# EAGLE design Power Board Mk.4 (EAGLE 6.1)
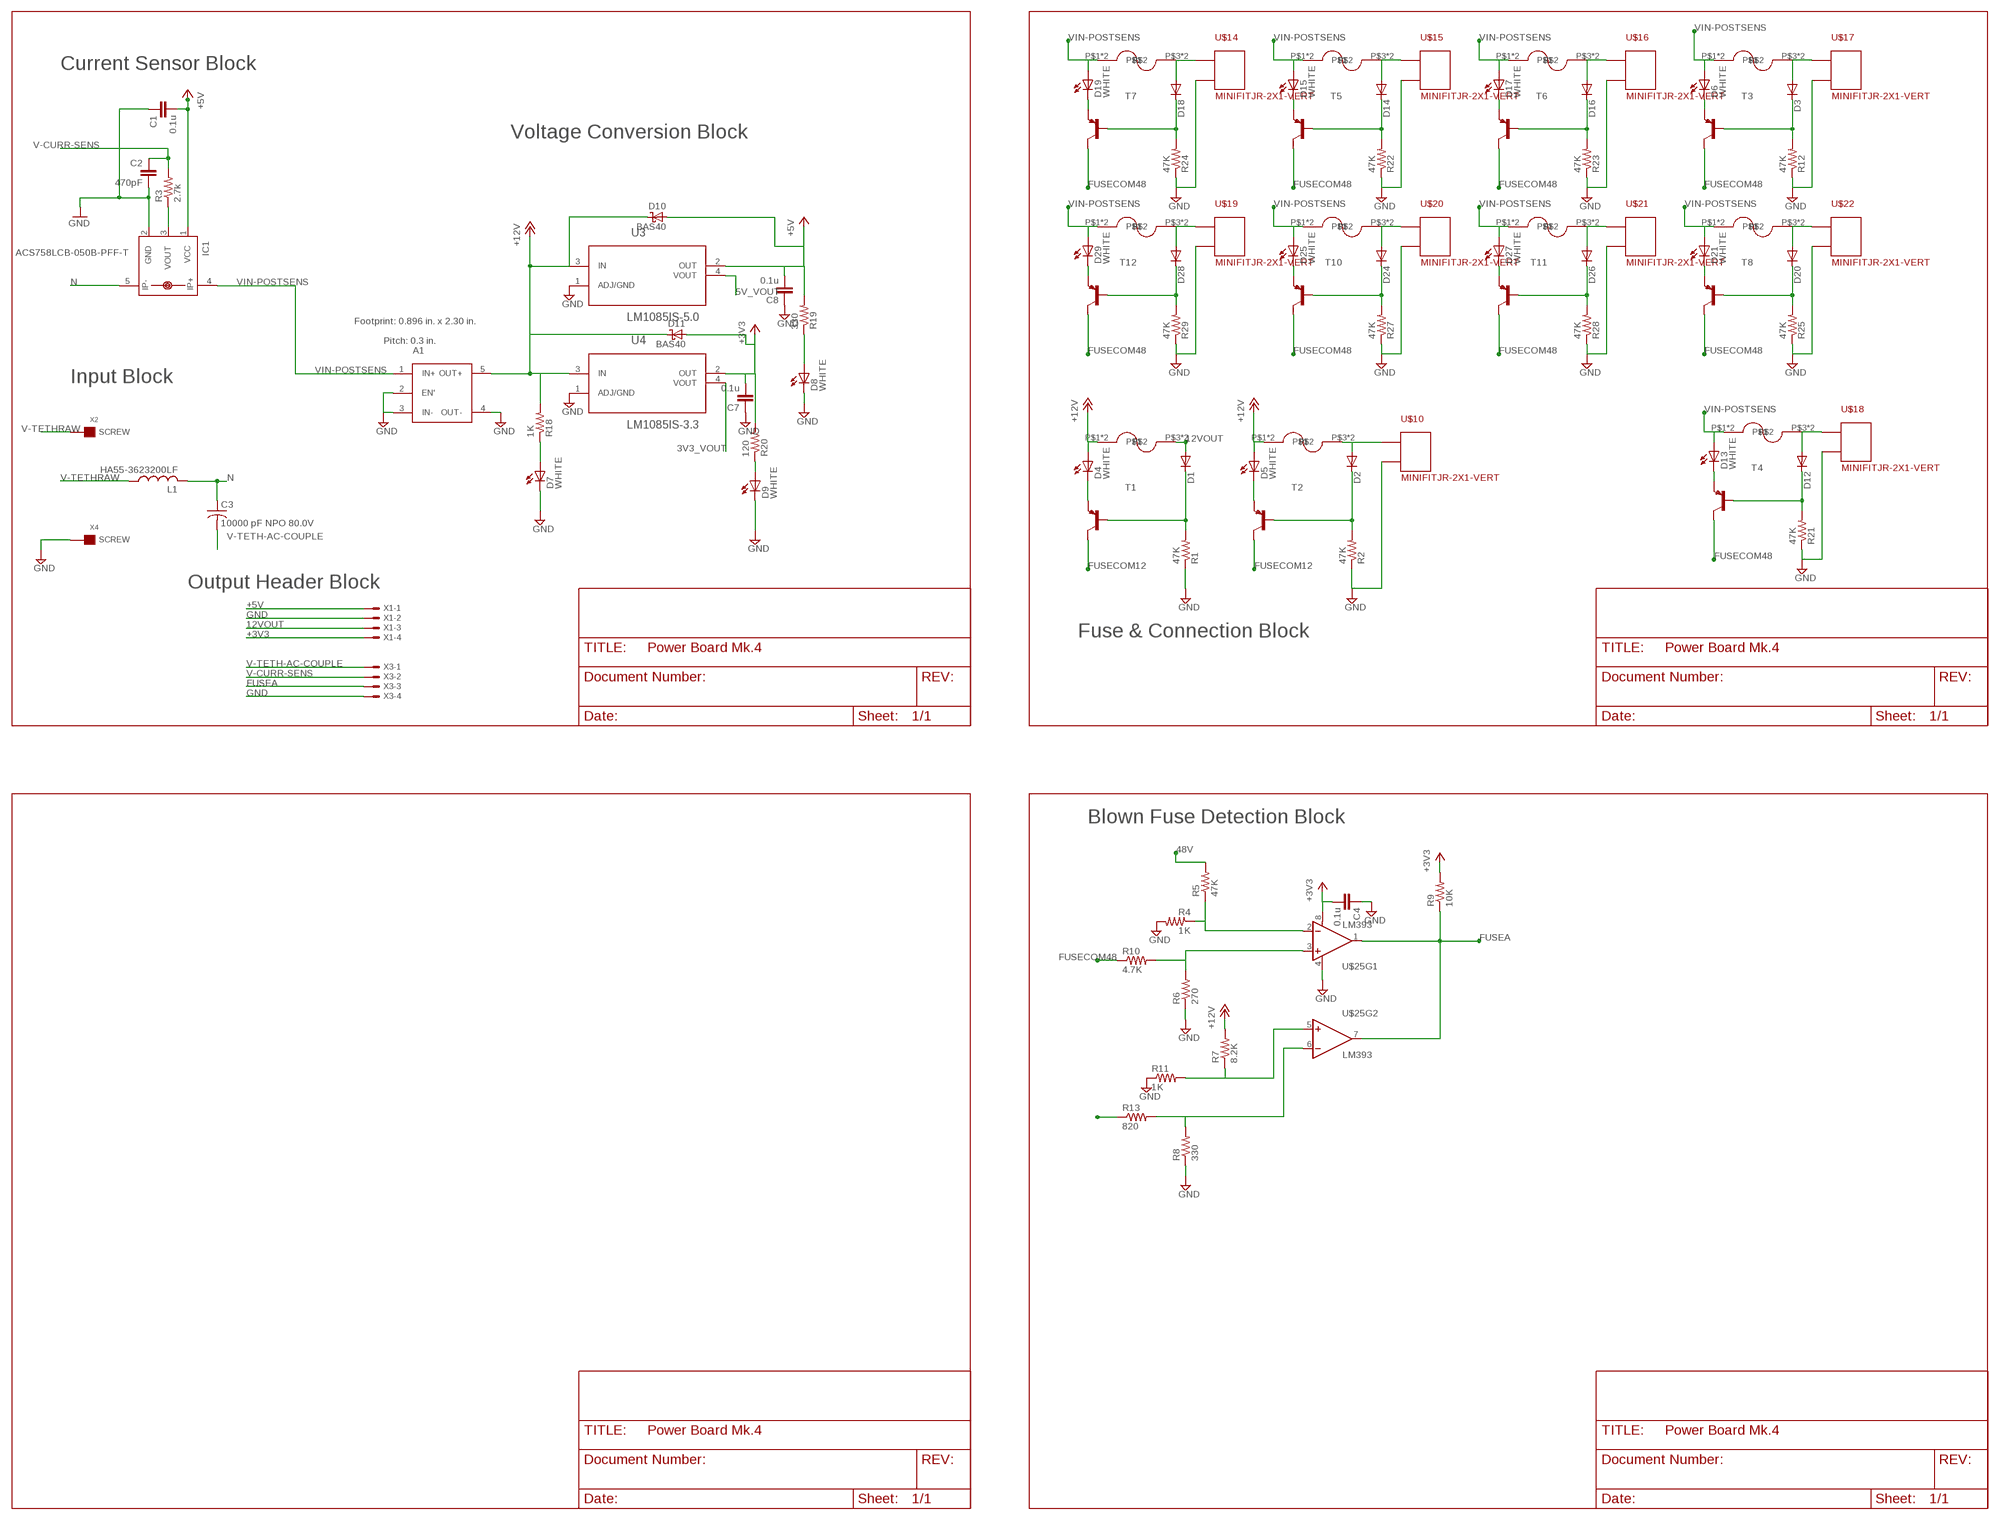
[diagram p0: schematic, sheet 1]

## Parts
A1  SQE48T20120  [BRICK]
C1  0.1u  CAP0805  [0805]
C2  470pF  CAP0805  [0805]
C3  10000 pF NPO 80.0V  C-USC0603  [C0603]
C4  0.1u  CAP0805  [0805]
C7  0.1u  CAP0805  [0805]
C8  0.1u  CAP0805  [0805]
D1  DIODEHV  [DIODE-HV]
D2  DIODEHV  [DIODE-HV]
D3  DIODEHV  [DIODE-HV]
D4  WHITE  LED-WHITE  [LED-1206]
D5  WHITE  LED-WHITE  [LED-1206]
D6  WHITE  LED-WHITE  [LED-1206]
D7  WHITE  LED-WHITE  [LED-1206]
D8  WHITE  LED-WHITE  [LED-1206]
D9  WHITE  LED-WHITE  [LED-1206]
D10  BAS40  [SOT23]
D11  BAS40  [SOT23]
D12  DIODEHV  [DIODE-HV]
D13  WHITE  LED-WHITE  [LED-1206]
D14  DIODEHV  [DIODE-HV]
D15  WHITE  LED-WHITE  [LED-1206]
D16  DIODEHV  [DIODE-HV]
D17  WHITE  LED-WHITE  [LED-1206]
D18  DIODEHV  [DIODE-HV]
D19  WHITE  LED-WHITE  [LED-1206]
D20  DIODEHV  [DIODE-HV]
D21  WHITE  LED-WHITE  [LED-1206]
D24  DIODEHV  [DIODE-HV]
D25  WHITE  LED-WHITE  [LED-1206]
D26  DIODEHV  [DIODE-HV]
D27  WHITE  LED-WHITE  [LED-1206]
D28  DIODEHV  [DIODE-HV]
D29  WHITE  LED-WHITE  [LED-1206]
IC1  ACS758LCB-050B-PFF-T  [CB-PFF]
L1  HA55-3623200LF  [THIND]
R1  47K  RESISTOR0805-RES  [0805]
R2  47K  RESISTOR0805-RES  [0805]
R3  2.7k  RESISTOR0805-RES  [0805]
R4  1K  RESISTOR0805-RES  [0805]
R5  47K  RESISTOR0805-RES  [0805]
R6  270  RESISTOR0805-RES  [0805]
R7  8.2K  RESISTOR0805-RES  [0805]
R8  330  RESISTOR0805-RES  [0805]
R9  10K  RESISTOR0805-RES  [0805]
R10  4.7K  RESISTOR0805-RES  [0805]
R11  1K  RESISTOR0805-RES  [0805]
R12  47K  RESISTOR0805-RES  [0805]
R13  820  RESISTOR0805-RES  [0805]
R18  1K  RESISTOR0805-RES  [0805]
R19  330  RESISTOR0805-RES  [0805]
R20  120  RESISTOR0805-RES  [0805]
R21  47K  RESISTOR0805-RES  [0805]
R22  47K  RESISTOR0805-RES  [0805]
R23  47K  RESISTOR0805-RES  [0805]
R24  47K  RESISTOR0805-RES  [0805]
R25  47K  RESISTOR0805-RES  [0805]
R27  47K  RESISTOR0805-RES  [0805]
R28  47K  RESISTOR0805-RES  [0805]
R29  47K  RESISTOR0805-RES  [0805]
T1  BC856BLT1-PNP-SOT23-BEC  [SOT23-BEC]
T2  BC856BLT1-PNP-SOT23-BEC  [SOT23-BEC]
T3  BC856BLT1-PNP-SOT23-BEC  [SOT23-BEC]
T4  BC856BLT1-PNP-SOT23-BEC  [SOT23-BEC]
T5  BC856BLT1-PNP-SOT23-BEC  [SOT23-BEC]
T6  BC856BLT1-PNP-SOT23-BEC  [SOT23-BEC]
T7  BC856BLT1-PNP-SOT23-BEC  [SOT23-BEC]
T8  BC856BLT1-PNP-SOT23-BEC  [SOT23-BEC]
T10  BC856BLT1-PNP-SOT23-BEC  [SOT23-BEC]
T11  BC856BLT1-PNP-SOT23-BEC  [SOT23-BEC]
T12  BC856BLT1-PNP-SOT23-BEC  [SOT23-BEC]
U3  LM1085IS-5.0  [TO254P1435X457-3N]
U4  LM1085IS-3.3  [TO254P1435X457-3N]
U$2  FUSEHOLDER3557-2  [FUSEHOLDER3557-2]
U$3  FUSEHOLDER3557-2  [FUSEHOLDER3557-2]
U$4  FUSEHOLDER3557-2  [FUSEHOLDER3557-2]
U$5  FUSEHOLDER3557-2  [FUSEHOLDER3557-2]
U$6  FUSEHOLDER3557-2  [FUSEHOLDER3557-2]
U$7  FUSEHOLDER3557-2  [FUSEHOLDER3557-2]
U$8  FUSEHOLDER3557-2  [FUSEHOLDER3557-2]
U$9  FUSEHOLDER3557-2  [FUSEHOLDER3557-2]
U$10  MINIFITJR-2X1-VERT  [5566-02B]
U$11  FUSEHOLDER3557-2  [FUSEHOLDER3557-2]
U$12  FUSEHOLDER3557-2  [FUSEHOLDER3557-2]
U$13  FUSEHOLDER3557-2  [FUSEHOLDER3557-2]
U$14  MINIFITJR-2X1-VERT  [5566-02B]
U$15  MINIFITJR-2X1-VERT  [5566-02B]
U$16  MINIFITJR-2X1-VERT  [5566-02B]
U$17  MINIFITJR-2X1-VERT  [5566-02B]
U$18  MINIFITJR-2X1-VERT  [5566-02B]
U$19  MINIFITJR-2X1-VERT  [5566-02B]
U$20  MINIFITJR-2X1-VERT  [5566-02B]
U$21  MINIFITJR-2X1-VERT  [5566-02B]
U$22  MINIFITJR-2X1-VERT  [5566-02B]
U$25  LM393  [SO08]
X1  KK-156-4  [KK-156-4]
X2  SCREW_TERM  [TERMINAL]
X3  KK-156-4  [KK-156-4]
X4  SCREW_TERM  [TERMINAL]

## Nets
3V3_VOUT: U4.4(VOUT)
5V_VOUT: U3.4(VOUT)
12VOUT: D1.A U$4.P$3 U$4.P$4 X1.3
12VOUT1: D2.A U$3.P$3 U$3.P$4 U$10.P$1
48V: R5.2
+3V3: C4.2 C7.2 D11.1(A) R9.2 R20.2 U4.2(OUT) U$25.8(V+) X1.4
+5V: C1.2 C8.2 D10.1(A) IC1.1(VCC) R19.2 U3.2(OUT) X1.1
+12V: A1.5(OUT+) D4.A D5.A D10.3(C) D11.3(C) R7.2 R18.2 U3.3(IN) U4.3(IN) U$3.P$1 U$3.P$2 U$4.P$1 U$4.P$2
FUSEA: R9.1 U$25.1(OUT) U$25.7(OUT) X3.3
FUSECOM12: R13.1 T1.C T2.C
FUSECOM48: R10.1 T3.C T4.C T5.C T6.C T7.C T8.C T10.C T11.C T12.C
GND: A1.2(EN') A1.3(IN-) A1.4(OUT-) C1.1 C2.2 C4.1 C7.1 C8.1 D7.C D8.C D9.C IC1.2(GND) R1.1 R2.1 R4.2 R6.1 R8.1 R11.1 R12.1 R21.1 R22.1 R23.1 R24.1 R25.1 R27.1 R28.1 R29.1 U3.1(ADJ/GND) U4.1(ADJ/GND) U$10.P$2 U$14.P$2 U$15.P$2 U$16.P$2 U$17.P$2 U$18.P$2 U$19.P$2 U$20.P$2 U$21.P$2 U$22.P$2 U$25.4(V-) X1.2 X3.4 X4.P$1(SCREW) X4.P$2(SCREW) X4.P$3(SCREW) X4.P$4(SCREW) X4.P$5(SCREW) X4.P$6(SCREW) X4.P$7(SCREW) X4.P$8(SCREW) X4.P$9(SCREW) X4.P$10(SCREW)
N: C3.1 IC1.5(IP-) L1.2
N$1: R4.1 R5.1 U$25.2(-IN)
N$2: IC1.3(VOUT) R3.1
N$4: R6.2 R10.2 U$25.3(+IN)
N$5: R7.1 R11.2 U$25.5(+IN)
N$6: R8.2 R13.2 U$25.6(-IN)
N$7: D2.C R2.2 T2.B
N$8: D5.C T2.E
N$9: D3.A U$2.P$3 U$2.P$4 U$17.P$1
N$10: D3.C R12.2 T3.B
N$11: D6.C T3.E
N$12: D1.C R1.2 T1.B
N$13: D4.C T1.E
N$21: D7.A R18.1
N$22: D8.A R19.1
N$23: D9.A R20.1
N$25: D12.C R21.2 T4.B
N$26: D13.C T4.E
N$28: D12.A U$5.P$3 U$5.P$4 U$18.P$1
N$29: D14.C R22.2 T5.B
N$30: D15.C T5.E
N$32: D14.A U$6.P$3 U$6.P$4 U$15.P$1
N$33: D16.C R23.2 T6.B
N$34: D17.C T6.E
N$36: D16.A U$7.P$3 U$7.P$4 U$16.P$1
N$37: D18.C R24.2 T7.B
N$38: D19.C T7.E
N$40: D18.A U$8.P$3 U$8.P$4 U$14.P$1
N$41: D20.C R25.2 T8.B
N$42: D21.C T8.E
N$44: D20.A U$9.P$3 U$9.P$4 U$22.P$1
N$49: D24.C R27.2 T10.B
N$50: D25.C T10.E
N$52: D24.A U$11.P$3 U$11.P$4 U$20.P$1
N$53: D26.C R28.2 T11.B
N$54: D27.C T11.E
N$56: D26.A U$12.P$3 U$12.P$4 U$21.P$1
N$57: D28.C R29.2 T12.B
N$58: D29.C T12.E
N$60: D28.A U$13.P$3 U$13.P$4 U$19.P$1
V-CURR-SENS: C2.1 R3.2 X3.2
V-TETH-AC-COUPLE: C3.2 X3.1
V-TETHRAW: L1.1 X2.P$1(SCREW) X2.P$2(SCREW) X2.P$3(SCREW) X2.P$4(SCREW) X2.P$5(SCREW) X2.P$6(SCREW) X2.P$7(SCREW) X2.P$8(SCREW) X2.P$9(SCREW) X2.P$10(SCREW)
VIN-POSTSENS: A1.1(IN+) D6.A D13.A D15.A D17.A D19.A D21.A D25.A D27.A D29.A IC1.4(IP+) U$2.P$1 U$2.P$2 U$5.P$1 U$5.P$2 U$6.P$1 U$6.P$2 U$7.P$1 U$7.P$2 U$8.P$1 U$8.P$2 U$9.P$1 U$9.P$2 U$11.P$1 U$11.P$2 U$12.P$1 U$12.P$2 U$13.P$1 U$13.P$2
Unconnected: IC1.IP+1 IC1.IP-1

## Notes on the sheet
- Current Sensor Block
- Voltage Conversion Block
- Footprint: 0.896 in. x 2.30 in.
- Pitch: 0.3 in.
- Input Block
- Output Header Block
- Fuse & Connection Block
- Blown Fuse Detection Block

## Library data of the parts
A1 = Power Board Library:SQE48T20120
C1 C2 C4 C7 C8 = SparkFun-Capacitors:CAP: Capacitor Standard 0603 ceramic capacitor, and 0.1" leaded capacitor.
C3 = resistor:C-US: CAPACITOR, American symbol
D1-D3 D12 D14 D16 D18 D20 D24 D26 D28 = SparkFun-DiscreteSemi:DIODE: Diode These are standard reverse protection diodes and small signal diodes. SMA package can handle up to about 1A. SOD-323 can handle about 200mA. What the SOD-323 package when ordering, there are some mfgs out there that are 5-pin packages.
D4-D9 D13 D15 D17 D19 D21 D25 D27 D29 = SparkFun-LED:LED-WHITE: White SMD LEDs LilyPad 1206- DIO-09955; PROD_ID: DIO-09955
D10 D11 = diode:BAS40: Silicon Schottky Diodes General-purpose diode for high-speed switching
IC1 = allegro:ACS758*: Thermally Enhanced, Fully Integrated, Hall Effect-Based Linear Current Sensor with 100 micro Ohm Current Conductor display layer 49 Reference in BRD and place VIAs on circles Source: http://www.allegromicro.com/en/Products/Part_Numbers/0758/0758.pdf; MPN: ACS758LCB-050B-PFF-T; OC_FARNELL: 1718997; OC_NEWARK: 04R7131
L1 = Power Board Library:HA55-3623200LF
R1-R13 R18-R25 R27-R29 = SparkFun-Resistors:RESISTOR: Resistor Basic schematic elements and footprints for 0603, 1206, and PTH resistors.
T1-T8 T10-T12 = transistor:*-PNP-: PNP Transistror
U3 = NSC_By_element14_Batch_1:LM1085IS-5.0: Low Dropout Positive Regulators; MPN: LM1085IS-5.0; OC_FARNELL: 1469040; OC_NEWARK: 41K3374; PACKAGE: TO-263-3; SUPPLIER: National Semiconductor
U4 = NSC_By_element14_Batch_1:LM1085IS-3.3: Low Dropout Positive Regulators; MPN: LM1085IS-3.3; OC_FARNELL: 1469039; OC_NEWARK: 41K3373; PACKAGE: TO-263-3; SUPPLIER: National Semiconductor
U$2-U$9 U$11-U$13 = Power Board Library:FUSEHOLDER3557-2
U$10 U$14-U$22 = Personal:MINIFITJR-2X1-VERT
U$25 = SparkFun:LM393
X1 X3 = con-molex:KK-156-4: KK 156 HEADER Source: http://www.molex.com/pdm_docs/sd/026604100_sd.pdf; OC_FARNELL: unknown; OC_NEWARK: unknown
X2 X4 = Power Board Library:SCREW_TERM: 10-pad Screw Terminal

## Board
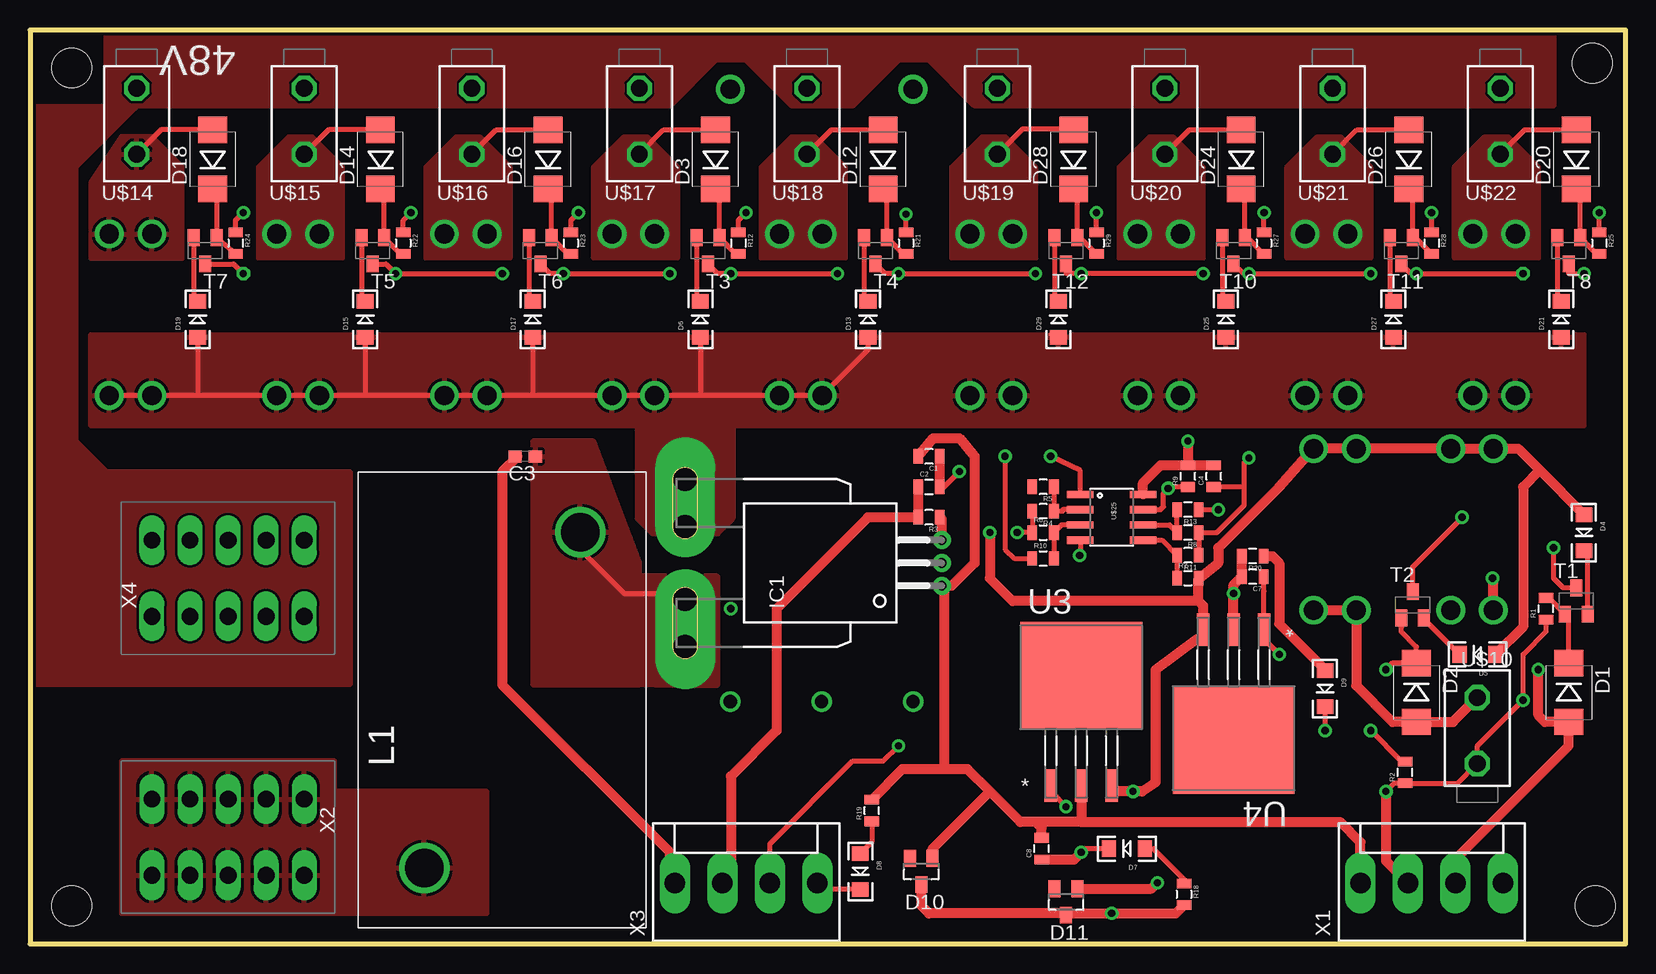
[diagram p1: board, top side]
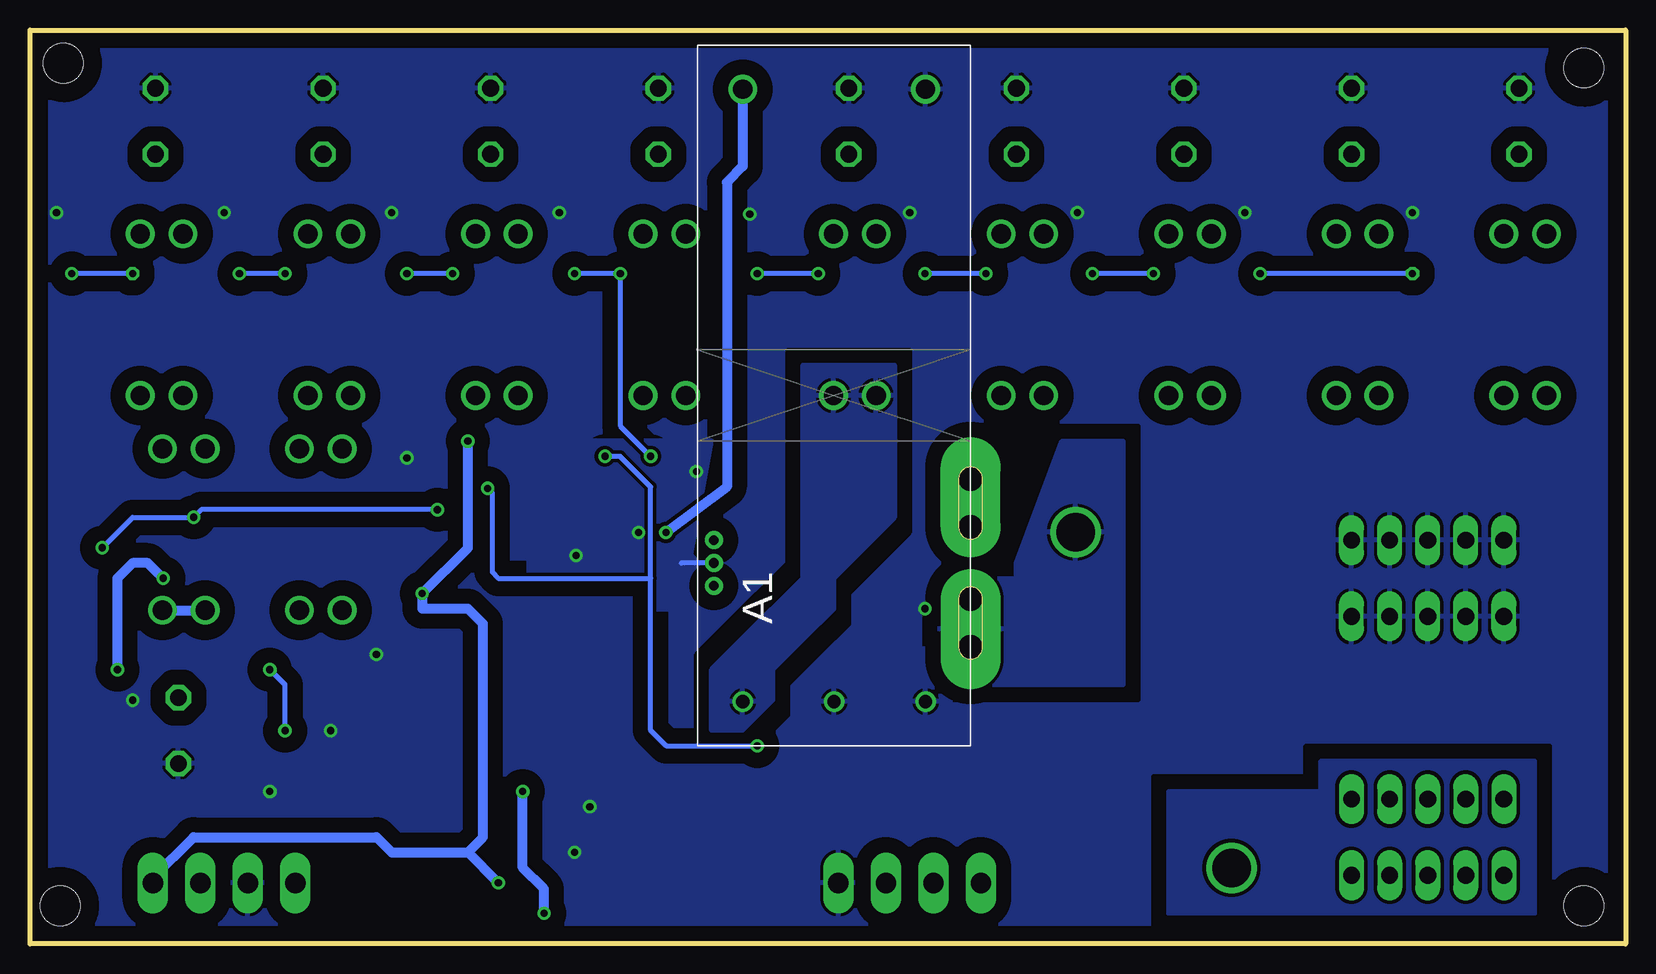
[diagram p2: board, bottom side, seen from below]

Size 133.02 x 76.19 mm. Coordinates in mm from the lower left corner, seen from the top.
Outline: 0,0 133.02,0 133.02,76.19 0,76.19 0,0
Copper layers (1*16): Top 0.035mm / dielectric 1.5mm / Bottom 0.035mm
Design rules: minimum track width 8mil, minimum drill 20mil, track to track 8mil, track to pad 8mil, pad to pad 8mil, via to via 8mil, smd to smd 8mil, copper to edge 10mil, drill to drill 8mil, minimum pad ring 12mil, minimum via ring 10mil, stop-mask expansion 4mil, vias tented up to drill 25mil, thermal gap 10mil

### Footprints (pad centres in the part's own frame; a part is rotated, then mirrored left to right if it is on the bottom)
BRICK = drill 1.1: 1 3.683,18.999; 2 3.683,11.379; 3 3.683,3.759 | drill 1.6: 4 54.737,3.759; 5 54.737,18.999
0805 = smd 0.8 x 1.2: 1 -0.9,0; 2 0.9,0
C0603 = smd 1.1 x 1: 1 -0.85,0; 2 0.85,0
DIODE-HV = smd 2.2 x 2.4: A 2.454,0; C -2.454,0
LED-1206 = smd 1.2 x 1.4: A -1.5,0; C 1.5,0
SOT23 = smd 1 x 1.4: 1 -0.95,-1.1; 2 0.95,-1.1; 3 0,1.1
CB-PFF = drill 0.8 pad 1.5: 1 -1.91,-21.4; 2 0,-21.4; 3 1.91,-21.4 | drill 2 pad 5 offset: 4 3,0; 5 -3,0 | drill 2 pad 4 offset: IP+1 7,0; IP-1 -7,0
THIND = drill 3.2: 1 -14,6.5; 2 14,-6.5
SOT23-BEC = smd 1 x 1.4: B -0.95,-1.1; C 0,1.1; E 0.95,-1.1
TO254P1435X457-3N = smd 1.016 x 2.692: 1 -2.54,-9.042; 2 0,-9.042; 3 2.54,-9.042 | smd 10.16 x 8.941: 4 0,0.152
FUSEHOLDER3557-2 = drill 1.6: P$1 0,0; P$2 0,3.556; P$3 13.462,0; P$4 13.462,3.556
5566-02B = drill 1.4 octagon: P$1 0,-2.75; P$2 0,2.75
STAND-OFF = hole 3.302: 0,0
SO08 = smd 0.61 x 2.21: 1 -1.905,-2.616; 2 -0.635,-2.616; 3 0.635,-2.616; 4 1.905,-2.616; 5 1.905,2.616; 6 0.635,2.616; 7 -0.635,2.616; 8 -1.905,2.616
KK-156-4 = drill 1.7 pad 2.184 long: 1 -5.94,0; 2 -1.98,0; 3 1.98,0; 4 5.94,0
TERMINAL = drill 1.4 long: P$1 -3.175,0; P$2 3.175,0; P$3 3.175,3.175; P$4 -3.175,3.175; P$5 -3.175,6.35; P$6 3.175,6.35; P$7 3.175,-3.175; P$8 3.175,-6.35; P$9 -3.175,-6.35; P$10 -3.175,-3.175

### Placement (x,y rotation side)
A1  54.61,16.51 90 bottom
C1  74.93,40.64 180 top
C2  74.93,38.1 0 top
C3  41.27,40.64 180 top
C4  98.68,38.99 90 top
C7  101.92,30.61 180 top
C8  84.33,7.94 90 top
D1  128.27,20.95 270 top
D2  115.57,20.95 270 top
D3  57.15,65.41 90 top
D4  129.54,34.29 270 top
D5  120.65,24.13 180 top
D6  55.88,52.07 90 top
D7  91.44,7.94 180 top
D8  69.22,6.03 270 top
D9  107.95,21.27 270 top
D10  74.3,6.03 180 top
D11  86.36,3.49 180 top
D12  71.12,65.41 90 top
D13  69.85,52.07 90 top
D14  29.21,65.41 90 top
D15  27.94,52.07 90 top
D16  43.18,65.41 90 top
D17  41.91,52.07 90 top
D18  15.24,65.41 90 top
D19  13.97,52.07 90 top
D20  128.91,65.41 90 top
D21  127.64,52.07 90 top
D24  100.97,65.41 90 top
D25  99.69,52.07 90 top
D26  114.94,65.41 90 top
D27  113.67,52.07 90 top
D28  87,65.41 90 top
D29  85.72,52.07 90 top
IC1  54.61,31.75 90 top
L1  39.37,20.32 90 top
R1  126.36,27.94 90 top
R2  114.62,14.29 90 top
R3  74.93,35.56 180 top
R4  84.45,36.07 180 top
R5  84.45,38.1 180 top
R6  84.45,34.29 0 top
R7  96.52,30.48 0 top
R8  96.52,34.29 180 top
R9  96.52,38.99 90 top
R10  84.45,32.13 0 top
R11  96.52,32.38 180 top
R12  59.05,58.42 270 top
R13  96.52,36.2 180 top
R18  96.2,4.13 270 top
R19  70.17,11.11 90 top
R20  101.92,32.32 180 top
R21  73.03,58.42 270 top
R22  31.11,58.42 270 top
R23  45.09,58.42 270 top
R24  17.14,58.42 270 top
R25  130.81,58.42 270 top
R27  102.87,58.42 270 top
R28  116.84,58.42 270 top
R29  88.9,58.42 270 top
T1  128.91,28.57 0 top
T2  115.25,28.26 0 top
T3  56.52,57.78 180 top
T4  70.48,57.78 180 top
T5  28.57,57.78 180 top
T6  42.55,57.78 180 top
T7  14.61,57.78 180 top
T8  128.27,57.78 180 top
T10  100.33,57.78 180 top
T11  114.3,57.78 180 top
T12  86.36,57.78 180 top
U3  87.63,22.23 0 top
U4  100.33,17.14 180 top
U$2  52.07,45.72 90 top
U$3  107,41.27 270 top
U$4  118.43,41.27 270 top
U$5  66.04,45.72 90 top
U$6  24.13,45.72 90 top
U$7  38.1,45.72 90 top
U$8  10.16,45.72 90 top
U$9  123.83,45.72 90 top
U$10  120.65,17.78 180 top
U$11  95.89,45.72 90 top
U$12  109.86,45.72 90 top
U$13  81.92,45.72 90 top
U$14  8.89,68.58 0 top
U$15  22.86,68.58 0 top
U$16  36.83,68.58 0 top
U$17  50.8,68.58 0 top
U$18  64.77,68.58 0 top
U$19  80.64,68.58 0 top
U$20  94.61,68.58 0 top
U$21  108.58,68.58 0 top
U$22  122.56,68.58 0 top
U$23  [STAND-OFF]  3.49,3.17 0 top
U$24  [STAND-OFF]  130.24,73.41 0 top
U$25  90.17,35.56 270 top
U$28  [STAND-OFF]  130.49,3.17 180 top
U$29  [STAND-OFF]  3.49,73.03 0 top
X1  116.84,5.08 0 top
X2  16.51,8.89 270 top
X3  59.69,5.08 0 top
X4  16.51,30.48 90 top

### Tracks (layer width: path | path; a pad name or v marks a point on that pad's centre or on a via)
12VOUT  (via drill 0.6)
  Top 0.813: U$4.P$4 121.98,30.42 v121.92,30.48 | v125.73,22.86 125.73,19.05 126.28,18.5 D1.A 128.27,16.51 118.82,7.06 X1.3
  Bottom 0.813: U$4.P$4 U$4.P$3 | v121.92,30.48 123.19,31.75 124.46,31.75 125.73,30.48 v125.73,22.86
12VOUT1
  Top 0.813: U$10.P$1 118.62,18.5 D2.A 113.58,18.5 110.55,21.53 U$3.P$4 U$3.P$3
+3V3  (via drill 0.6)
  Top 0.813: D11.1 93.49,4.59 v93.98,5.08 | C4.2 R9.2 | C7.2 R20.2 | C7.2 100.97,30.55 | C7.2 100.33,29.92 v100.33,29.21 U4.2 | U$25.8 92.79,38.43 94.25,39.89 R9.2 | v96.52,41.91 R9.2
  Bottom 0.813: v93.98,5.08 96.52,7.62 | v96.52,41.91 96.52,33.02 v100.33,29.21 100.33,27.94 96.52,27.94 95.25,26.67 95.25,8.89 96.52,7.62 | 96.52,7.62 102.87,7.62 104.14,8.89 119.38,8.89 122.78,5.49 X1.4
+5V
  Top 0.813: X1.1 110.9,8.48 109.22,10.16 87.63,10.16 | C1.2 75.3,42.16 77.47,42.16 78.74,40.64 78.74,31.75 76.83,29.84 IC1.1 76.2,29.65 76.2,14.55 | U3.2 87.63,10.16 | 80.01,12.7 82.55,10.16 83.82,10.16 | 80.01,12.7 78.16,14.55 76.2,14.55 | 76.2,14.55 72.71,14.55 R19.2 | D10.1 75.25,7.93 80.01,12.7 | 87.63,10.16 83.82,10.16 | C8.2 84.33,9.65 83.82,10.16
+12V  (via drill 0.6)
  Top 0.813: 125.84,39.48 124.06,41.27 U$4.P$2 U$4.P$1 U$3.P$2 U$3.P$1 104.14,38.1 99.06,33.02 99.06,31.75 R7.2 97.41,28.57 | 125.84,39.48 D4.A 129.54,35.56 | D5.A 124.46,26.44 124.46,38.1 125.84,39.48 | v80.01,34.29 80.01,30.48 81.92,28.57 97.41,28.57 | 97.41,28.57 97.79,28.19 U4.3 97.79,25.4 97.28,25.4 93.85,22.86 93.85,13.46 92.71,12.7 v91.95,12.7 90.65,12.7 U3.3 | D10.3 74.3,3.17 74.93,2.54 86.21,2.54 D11.3 86.51,2.54 v90.17,2.54 95.52,2.54 R18.2
  Bottom 0.813: v80.01,34.29 74.93,38.1 74.93,63.5 73.61,64.82 A1.5 | v90.17,2.54 90.17,4.57 91.95,6.35 v91.95,12.7
FUSEA  (via drill 0.6)
  Top 0.406: X3.3 61.67,8.33 68.58,15.24 71.12,15.24 v72.39,16.51 | U$25.1 87.55,39.45 v85.09,40.64 | R9.1 94.98,38.09 v94.87,37.97 94.49,37.59 94.49,36.45 94.23,36.2 U$25.7
  Bottom 0.406: 81.28,30.48 81.28,17.78 80.01,16.51 v72.39,16.51 | v85.09,40.64 83.82,40.64 81.28,38.1 81.28,30.48 | 81.28,30.48 93.98,30.48 94.49,30.99 94.49,37.59 v94.87,37.97
FUSECOM12  (via drill 0.6)
  Top 0.406: T1.C 127.81,29.68 127,30.48 v127,33.02 | T2.C 115.25,31.43 v119.38,35.56 | R13.1 v99.06,36.2
  Bottom 0.406: v127,33.02 124.46,35.56 v119.38,35.56 118.75,36.2 v99.06,36.2
FUSECOM48  (via drill 0.6)
  Top 0.406: T12.C 86.36,55.88 v87.63,55.88 v97.79,55.88 | T10.C 101.14,55.88 v101.6,55.88 v111.76,55.88 | T11.C 115.11,55.88 v115.57,55.88 v124.46,55.88 | T6.C 43.35,55.88 v44.45,55.88 v53.34,55.88 | T3.C 57.32,55.88 v58.42,55.88 v67.31,55.88 | T4.C 71.29,55.88 v72.39,55.88 v83.82,55.88 | v39.37,55.88 v30.48,55.88 29.68,56.69 T5.C | T7.C 16.98,56.69 v17.78,55.88 | T8.C 128.27,55.88 v129.54,55.88 | v81.28,40.64 81.28,32.89 82.04,32.13 R10.1
  Bottom 0.406: v97.79,55.88 v101.6,55.88 | v111.76,55.88 v115.57,55.88 | v39.37,55.88 v44.45,55.88 | v53.34,55.88 v58.42,55.88 | v67.31,55.88 v72.39,55.88 | v17.78,55.88 v30.48,55.88 | v124.46,55.88 v129.54,55.88 | v87.63,55.88 v83.82,55.88 83.82,43.18 v81.28,40.64
GND  (via drill 0.6)
  Top 0.406: R1.1 126.36,26.04 124.46,24.13 v124.46,20.32 120.65,16.51 U$10.P$2 119.01,13.39 R2.1 113.72,13.39 v113.03,12.7 | 89.53,8.34 D7.C 87.95,7.94 v87.63,7.62 | R4.2 R6.1 v82.3,34.29 | R11.1 R8.1 98.93,34.29 101.22,36.58 101.22,38.09 | R29.1 v88.9,60.96 | R27.1 v102.87,60.96 | R28.1 v116.84,60.96 | R25.1 v130.81,60.96 | R24.1 17.14,60.33 v17.78,60.96 | R22.1 31.11,60.33 v31.75,60.96 | R23.1 45.09,60.33 v45.72,60.96 | R12.1 59.05,60.33 v59.69,60.96 | R21.1 v73.03,60.83 | D9.C v107.95,17.78 | C7.1 102.87,29.39 U4.1 102.87,25.4 v104.14,24.13 | 101.22,38.09 C4.1 | 101.22,38.09 101.22,40.13 v101.6,40.51 | U3.1 85.09,12.7 v86.36,11.43 | D8.C 66.18,4.53 X3.4 | U$25.4 87.55,32.44 v87.5,32.38 | C2.2 76.2,38.1 v77.47,39.37
  Top 0.813: C1.1 C2.2 | C8.1 87.05,7.04 v87.63,7.62 | v113.03,12.7 113.03,6.91 X1.2
  Bottom 0.406: IC1.2 78.74,31.75
  other vias: 58.42,27.94
  pour Bottom (isolate 1.27, rank 2): 0,76.2 133.35,76.2 133.35,0 0,0
  pour Bottom (isolate 0.305): 76.2,41.91 91.44,41.91 91.44,27.94 78.74,27.94
N
  Top 0.406: L1.2 45.87,32.87 49.53,29.21 54.15,29.21 IC1.5
  pour Top: 41.91,41.91 41.91,21.59 50.8,21.59 50.8,31.75 46.99,41.91
  pour Top (no thermals): 57.15,30.48 49.53,30.48 49.53,21.84 57.15,21.72
  pour Bottom (isolate 0.305): 7.62,15.24 7.62,2.54 38.1,2.54 38.1,12.7 25.4,12.7 25.4,15.24
  pour Bottom: 41.91,41.91 41.91,21.59 57.15,21.59 57.15,30.48 50.8,30.48 50.8,31.75 46.99,41.91
N$1
  Top 0.406: U$25.2 86.09,36.2 86.09,36.07 R4.1 R5.1
N$2
  Top 0.813: IC1.3 76.01,35.38 R3.1
N$3
  pour Top: 6.35,39.37 26.67,39.37 26.67,21.59 0,21.59 0,69.85 5.08,69.85 6.35,69.85 6.35,76.2 127,76.2 127,69.85 78.74,69.85 74.93,73.66 72.39,73.66 68.58,69.85 63.5,69.85 59.69,73.66 57.15,73.66 53.34,69.85 8.89,69.85 3.81,64.77 3.81,41.91
N$4
  Top 0.406: U$25.3 85.99,34.92 R6.2 R10.2
N$5
  Top 0.406: 92.08,33.66 U$25.5 94.35,33.66 R11.2 R7.1
N$6
  Top 0.406: R13.2 R8.2 94.98,34.92 U$25.6
N$7  (via drill 0.6)
  Top 0.406: T2.B 114.3,26.36 114.3,26.35 114.3,26.04 115.57,24.77 D2.C 113.58,23.41 v113.03,22.86 | R2.2 114.35,15.19 v111.76,17.78
  Bottom 0.406: v113.03,22.86 111.76,21.59 v111.76,17.78
N$8
  Top 0.406: T2.E 116.2,27.08 D5.C
N$9
  Top 0.406: U$17.P$1 52.83,67.86 D3.A
  pour Top (no thermals): 53.98,57.15 46.99,57.15 46.99,64.77 49.53,67.31 51.44,67.31 53.98,64.77
N$10
  Top 0.406: R12.2 58.83,57.52 T3.B 57.47,62.64 D3.C
N$11
  Top 0.406: T3.E 55.56,53.25 D6.C
N$12
  Top 0.406: R1.2 126.59,28.84 T1.B 128.27,27.16 D1.C
N$13
  Top 0.406: T1.E 129.85,32.48 D4.C
N$21
  Top 0.406: D7.A 93.66,7.94 96.2,5.4 R18.1
N$22
  Top 0.406: R19.1 70.17,8.48 D8.A
N$23
  Top 0.813: R20.1 103.57,32.32 104.14,31.75 104.14,26.67 107.95,22.86 D9.A
N$25
  Top 0.406: R21.2 72.8,57.52 T4.B 71.44,62.64 D12.C
N$26
  Top 0.406: T4.E 69.53,53.25 D13.C
N$28
  Top 0.406: U$18.P$1 66.8,67.86 D12.A
  pour Top (no thermals): 67.94,57.15 60.96,57.15 60.96,64.77 63.5,67.31 65.41,67.31 67.94,64.77
N$29
  Top 0.406: R22.2 30.89,57.52 T5.B 29.52,62.64 D14.C
N$30
  Top 0.406: T5.E 27.62,53.25 D15.C
N$32
  Top 0.406: 29.21,67.94 D14.A 24.89,67.86 U$15.P$1
  pour Top (no thermals): 26.04,57.15 19.05,57.15 19.05,64.77 21.59,67.31 23.5,67.31 26.04,64.77
N$33
  Top 0.406: R23.2 44.86,57.52 T6.B 43.49,62.55 42.55,63.5 42.63,63.5 D16.C
N$34
  Top 0.406: T6.E 41.59,53.25 D17.C
N$36
  Top 0.406: U$16.P$1 38.86,67.86 D16.A
  pour Top (no thermals): 40.01,57.15 33.02,57.15 33.02,64.77 35.56,67.31 37.47,67.31 40.01,64.77
N$37
  Top 0.406: D18.C 15.55,62.64 T7.B 15.76,58.69 R24.2
N$38
  Top 0.406: T7.E 13.65,53.25 D19.C
N$40
  Top 0.406: 15.24,67.94 D18.A 10.92,67.86 U$14.P$1
  pour Top: 5.08,57.15 12.7,57.15 12.7,64.77 10.16,67.31 7.62,67.31 5.08,63.5
N$41
  Top 0.406: T8.B 129.22,62.64 D20.C | 129.44,58.88 T8.B | R25.2 130.59,57.52 T8.B
N$42
  Top 0.406: T8.E 127.32,53.25 D21.C
N$44
  Top 0.406: U$22.P$1 124.58,67.86 D20.A
  pour Top (no thermals): 125.73,57.15 118.75,57.15 118.75,64.77 121.28,67.31 123.19,67.31 125.73,64.77
N$49
  Top 0.406: D24.C 101.28,62.64 T10.B 101.5,58.88 R27.2
N$50
  Top 0.406: T10.E 99.38,53.97 99.69,53.66 D25.C
N$52
  Top 0.406: U$20.P$1 96.64,67.86 D24.A
  pour Top (no thermals): 97.79,57.15 90.81,57.15 90.81,64.77 93.34,67.31 95.25,67.31 97.79,64.77
N$53
  Top 0.406: D26.C 115.25,62.64 T11.B 115.47,58.88 R28.2
N$54
  Top 0.406: T11.E 113.35,53.25 D27.C
N$56
  Top 0.406: U$21.P$1 110.61,67.86 D26.A
  pour Top (no thermals): 111.76,57.15 104.78,57.15 104.78,64.77 107.31,67.31 109.22,67.31 111.76,64.77
N$57
  Top 0.406: D28.C 87.31,62.64 T12.B 87.53,58.88 R29.2
N$58
  Top 0.406: T12.E 85.41,53.25 D29.C
N$60
  Top 0.406: U$19.P$1 82.76,67.94 87,67.94
  Top 0.813: 87,67.94 D28.A
  pour Top (no thermals): 83.82,57.15 76.83,57.15 76.83,64.77 79.38,67.31 81.28,67.31 83.82,64.77
V-CURR-SENS
  Top 0.813: C2.1 R3.2 69.85,35.56 62.23,27.94 62.23,17.78 58.42,13.97 58.42,5.79 X3.2
V-TETH-AC-COUPLE
  Top 0.813: X3.1 53.34,5.49 53.34,7.62 39.37,21.59 39.37,39.37 40.64,40.64 C3.2
V-TETHRAW
  pour Top: 7.62,15.24 7.62,2.54 38.1,2.54 38.1,12.7 25.4,12.7 25.4,15.24
VIN-POSTSENS
  Top 0.406: D19.A 13.97,45.72 | D15.A 27.94,45.72 | D17.A 41.91,45.72 | D6.A 55.88,45.72 | 69.85,50.8 D13.A 69.85,49.53 U$5.P$1 U$5.P$2 55.88,45.72 | 55.88,45.72 U$2.P$1 U$2.P$2 41.91,45.72 | 41.91,45.72 U$7.P$1 U$7.P$2 27.94,45.72 | 27.94,45.72 U$6.P$1 U$6.P$2 13.97,45.72 | 13.97,45.72 U$8.P$1 U$8.P$2 | 85.09,50.8 85.5,50.8 D29.A
  pour Top: 5.08,50.8 129.54,50.8 129.54,43.18 5.08,43.18
  pour Bottom (isolate 0.305): 71.12,20.32 73.66,17.78 76.2,17.78 76.2,22.86 73.66,25.4 68.58,30.48 68.58,48.26 60.96,48.26 60.96,40.64 60.96,35.56 66.04,30.48 66.04,27.94 68.58,25.4 71.12,22.86
  pour Top (no thermals): 50.8,43.18 50.8,35.56 52.07,34.29 57.15,34.29 58.42,35.56 58.42,43.18

### Text on the board
tPlace: 48V